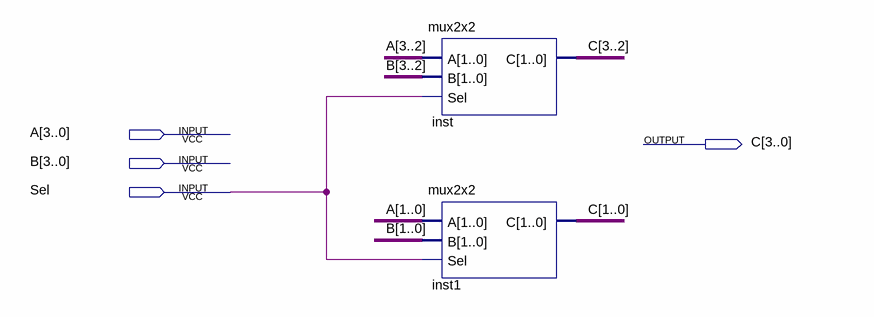
[diagram p0: schematic sheet]
// Quartus schematic mux2x4.bdf as structural Verilog: 2 symbols, 4 pins
module mux2x4 (
  input  [3:0] A,
  input  [3:0] B,
  input  Sel,
  output [3:0] C
);

  mux2x2 inst (.A(A[3:2]), .B(B[3:2]), .Sel(Sel), .C(C[3:2]));
  mux2x2 inst1 (.A(A[1:0]), .B(B[1:0]), .Sel(Sel), .C(C[1:0]));
endmodule
